# EasyEDA Pro project raspiblitz-barracuda-connections.epro

# Schematic Schematic1
Board Name: Board1; Create Date: 2026-02-22; Page Name: P1; Project Name: Raspberry Pi Fan Control; Schematic Name: Schematic1; Update Date: 2026-02-21; Company: EasyEDA.com; Page Size: A4; Version: V1.0
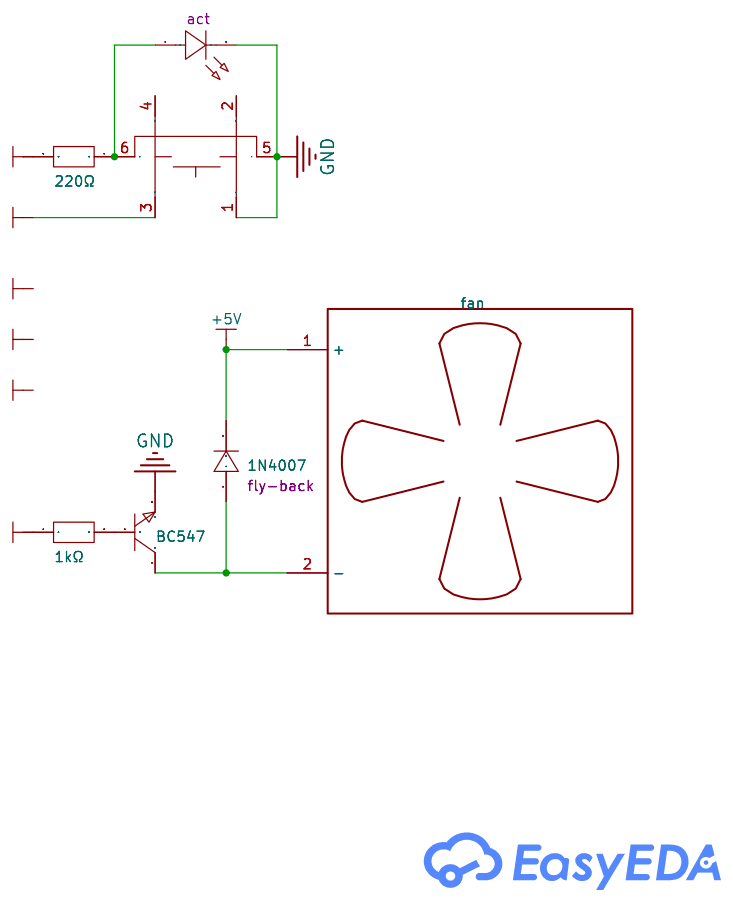
[diagram p0: schematic sheet]

## Parts
D1  1N4007  [DO-41_BD2.4-L4.7-P8.70-D0.9-RD]
LED1  TZ-L2-03YYBY2YDJ30-001  [LED-TH_BD3.0-P2.54-FD_YELLOW]  (no BOM)
Q1  BC547  [TO-92-3_L4.9-W3.7-P1.27-L]
R1  1kΩ  [RES-TH_BD2.7-L6.2-P10.20-D0.4]
R2  220Ω  [RES-TH_BD2.2-L6.5-P10.50-D0.6]
SW1  TM-001-D2-04  [SW-TH_TM-001-D2-04]
U2  fan

## Library data of the parts
D1 = 1N4007G_C2457: Diode Configuration:- Voltage - Forward(Vf@If):1.1V@1A Voltage - DC Reverse(Vr):1kV Current - Rectified:1A Reverse Leakage Current (Ir):5uA@1kV Non-Repetitive Peak Forward Surge Current:30A Operating Junction Temperature Range:-65℃~+150℃ Operating Junctio; LCSC Part Name: 1N4007G; Supplier Part: C2457; Manufacturer: MDD(辰达半导体); Supplier Footprint: DO-41; JLCPCB Part Class: Extended Part; Datasheet: https://item.szlcsc.com/datasheet/1N4007G/2834.html; Supplier: LCSC; Voltage - Forward(Vf@If): 1.1V@1A; Voltage - DC Reverse(Vr): 1kV; Current - Rectified: 1A; Reverse Leakage Current (Ir): 5uA@1kV; Non-Repetitive Peak Forward Surge Current: 30A; Operating Junction Temperature Range: -65℃~+150℃; Comment: fly-back
LED1 = TZ-L2-03YYBY2YDJ30-001: Lamp Holder Type:3mm Round Lens Illumination Color:Yellow Power(Watts):60mW Forward Current:- Wavelength - Dominant:590nm~595nm Wavelength - Dominant:590nm~595nm Peak Wavelength:- Diode Configuration:- Lens Color:Yellow Lens Color Temperature:- Color Temp; LCSC Part Name: 黄灯; Supplier Part: C779430; Manufacturer: TUOZHAN(拓展光电); Supplier Footprint: 插件,D=3mm; JLCPCB Part Class: Extended Part; Datasheet: https://item.szlcsc.com/datasheet/TZ-L2-03YYBY2YDJ30-001/829091.html; Supplier: LCSC; Lamp Holder Type: 3mm Round Lens; Illumination Color: Yellow; Power(Watts): 60mW; Wavelength - Dominant: 590nm~595nm; Lens Color: Yellow Lens; Viewing Angle: 30°; Operating Temperature: -20℃~+75℃; Comment: act
Q1 = BC547B: type:NPN Current - Collector(Ic):100mA Collector - Emitter Voltage VCEO:45V Pd - Power Dissipation:625mW DC Current Gain:200@2mA,5V DC Current Gain:200@2mA,5V Transition frequency(fT):150MHz Current - Collector Cutoff:100nA Vce Saturation(VCE(sat)):300mV; LCSC Part Name: NPN 电流:100mA 电压:45V; Supplier Part: C713613; Manufacturer: LGE(鲁光); Supplier Footprint: TO-92; JLCPCB Part Class: Extended Part; Datasheet: https://item.szlcsc.com/datasheet/BC547B/753738.html; Supplier: LCSC; type: NPN; Current - Collector(Ic): 100mA; Collector - Emitter Voltage VCEO: 45V; Pd - Power Dissipation: 625mW; DC Current Gain: 200@2mA,5V; Transition frequency(fT): 150MHz; Current - Collector Cutoff: 100nA; Vce Saturation(VCE(sat)): 300mV; Emitter-Base Voltage(Vebo): 6V
R1 = MF1/4W-1K±1%-ST52: Type:Metal Film Resistor Resistance:1kΩ Tolerance:±1% Tolerance:±1% Voltage-Supply(Max):250V Power(Watts):250mW Temperature Coefficient:±100ppm/℃ Temperature Coefficient:±100ppm/℃ Operating Temperature:-55℃~+155℃ Operating Temperature:-55℃~+155℃; LCSC Part Name: 金属膜电阻 1kΩ ±1% 250mW; Supplier Part: C2903245; Manufacturer: VO(翔胜); Supplier Footprint: 插件,D2.7xL6.2mm; JLCPCB Part Class: Extended Part; Datasheet: https://item.szlcsc.com/datasheet/MF1%252F4W-1K%25C2%25B11%2525-ST52/3158996.html; Supplier: LCSC; Type: Metal Film Resistor; Tolerance: ±1%; Voltage-Supply(Max): 250V; Power(Watts): 250mW; Temperature Coefficient: ±100ppm/℃; Operating Temperature: -55℃~+155℃
R2 = MF1/4W-220Ω±1% T: Type:Metal Film Resistors Resistance: Tolerance:±1% Tolerance:±1% Voltage-Supply(Max):250V Power(Watts):250mW Temperature Coefficient:±100ppm/℃ Temperature Coefficient:±100ppm/℃ Operating Temperature:-55℃~+155℃ Operating Temperature:-55℃~+155℃; LCSC Part Name: 220Ω ±1% 250mW 金属膜电阻 圆柱状直插; Supplier Part: C127220; Manufacturer: CCO(千志电子); Supplier Footprint: 插件,D2.3xL6.5mm; JLCPCB Part Class: Extended Part; Datasheet: https://atta.szlcsc.com/upload/public/pdf/source/20190910/C427326_62A6D058BC0FF74963A2F22379CA06CE.pdf; Supplier: LCSC; Type: Metal Film Resistors; Tolerance: ±1%; Voltage-Supply(Max): 250V; Power(Watts): 250mW; Temperature Coefficient: ±100ppm/℃; Operating Temperature: -55℃~+155℃
SW1 = TM-001-D2-04: Circuit:SPST Actuator Style:Round Button Operating Force:2.6N Mounting Type:Through Hole Length:6mm Width:6mm Switch Height:10.2mm with Bracket:Without Bracket Contact Current:50mA Voltage Rating:12V Actuator/Cap Color:Silver With Lamp:Yellow Termination; LCSC Part Name: 6*6*10.2mm 直插 轻触开关; Supplier Part: C2684716; Manufacturer: XKB Connection(中国星坤); Supplier Footprint: 插件,6x6mm; JLCPCB Part Class: Extended Part; Datasheet: https://item.szlcsc.com/datasheet/TM-001-D2-04/2783278.html; Supplier: LCSC; Circuit: SPST; Actuator Style: Round Button; Operating Force: 2.6N; Mounting Type: Through Hole; Length: 6mm; Width: 6mm; Switch Height: 10.2mm; with Bracket: Without Bracket; Contact Current: 50mA; Voltage Rating: 12V; Actuator/Cap Color: Silver; With Lamp: Yellow; Termination Style: PC Pin; Life: 100,000 Cycles; Operating Temperature: -25℃~+80℃
U2 = fan: Manufacturer Part: ?; Contributor: novasilisko; timeStamp: 1467237407; spicePre: U

## Nets
+5V: D1.1(C) U2.1(+)
GND: LED1.2(K) Q1.3(E) SW1.1 SW1.5(-)
GPIO3: SW1.3
GPIO14: R1.1
GPIO16: R2.2
Net-(D1-2): D1.2(A) Q1.1(C) U2.2(-)
Net-(LED1-1): LED1.1(A) R2.1 SW1.6(+)
Net-(Q1-2): Q1.2(B) R1.2

Not connected (* = marked no-connect by the designer): SW1 2 4
